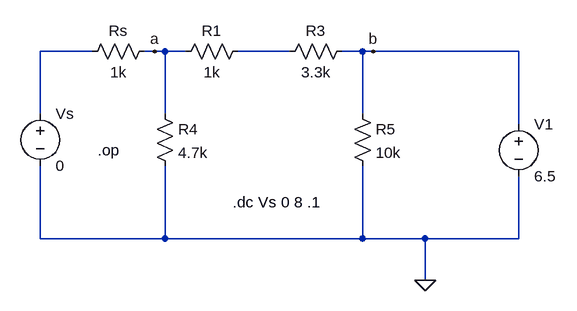
[diagram p0: schematic Task-1_22101008.asc.asc]
Task-1_22101008.asc.asc, the LTspice schematic file:
Version 4
SHEET 1 880 680
WIRE 144 32 64 32
WIRE 240 32 224 32
WIRE 256 32 240 32
WIRE 288 32 256 32
WIRE 448 32 368 32
WIRE 560 32 528 32
WIRE 576 32 560 32
WIRE 800 32 576 32
WIRE 64 128 64 32
WIRE 256 128 256 32
WIRE 560 128 560 32
WIRE 800 144 800 32
WIRE 64 320 64 208
WIRE 256 320 256 208
WIRE 256 320 64 320
WIRE 560 320 560 208
WIRE 560 320 256 320
WIRE 656 320 560 320
WIRE 800 320 800 224
WIRE 800 320 656 320
WIRE 656 384 656 320
FLAG 240 32 a
FLAG 576 32 b
FLAG 656 384 0
SYMBOL voltage 64 112 R0
SYMATTR InstName Vs
SYMATTR Value 0
SYMBOL res 240 112 R0
SYMATTR InstName R4
SYMATTR Value 4.7k
SYMBOL res 544 112 R0
SYMATTR InstName R5
SYMATTR Value 10k
SYMBOL res 128 48 R270
WINDOW 0 32 56 VTop 2
WINDOW 3 0 56 VBottom 2
SYMATTR InstName Rs
SYMATTR Value 1k
SYMBOL res 384 16 R90
WINDOW 0 0 56 VBottom 2
WINDOW 3 32 56 VTop 2
SYMATTR InstName R1
SYMATTR Value 1k
SYMBOL res 544 16 R90
WINDOW 0 0 56 VBottom 2
WINDOW 3 32 56 VTop 2
SYMATTR InstName R3
SYMATTR Value 3.3k
SYMBOL voltage 800 128 R0
SYMATTR InstName V1
SYMATTR Value 6.5
TEXT 152 184 Left 2 !.op
TEXT 360 264 Left 2 !.dc Vs 0 8 .1

The netlist it stands for:
* Task-1_22101008.asc.asc
Vs N001 0 0
R4 a 0 4.7k
R5 b 0 10k
Rs N001 a 1k
R1 N002 a 1k
R3 b N002 3.3k
V1 b 0 6.5
.op
.dc Vs 0 8 .1
.backanno
.end